# Altium project Radio_DownConverter.PrjPcb
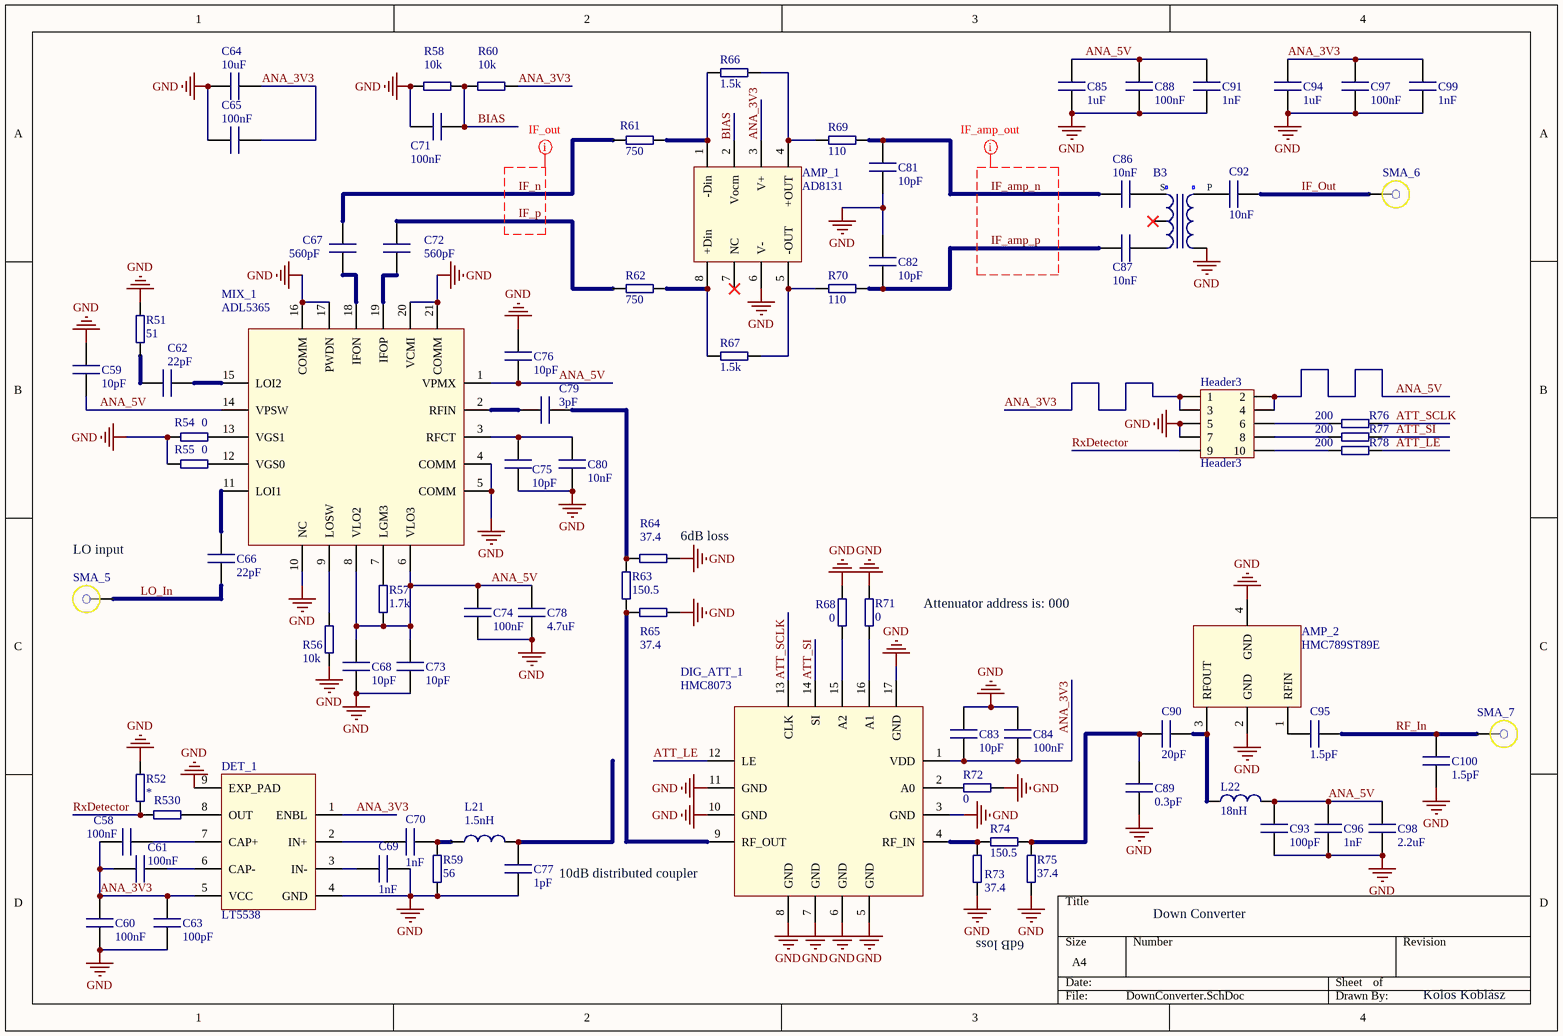
[diagram p0: DownConverter.SchDoc]
1 sheet, 83 parts. Net scope: global (net labels, ports and power ports of the same name join across sheets).

## Sheet DownConverter.SchDoc
size A4; DocumentNumber: 9; SheetNumber: 9; SheetTotal: 9

### Parts
AMP_1  AD8131
AMP_2  HMC789ST89E
B3  Balun  [Balun_Coil]  (value not drawn)
C58  value 100nF  [0805 SMD Passive]  (hidden comment: Cap1)
C59  value 10pF  [0805 SMD Passive]  (hidden comment: Cap1)
C60  value 100nF  [0805 SMD Passive]  (hidden comment: Cap1)
C61  value 100nF  [0805 SMD Passive]  (hidden comment: Cap1)
C62  value 22pF  [0805 SMD Passive]  (hidden comment: Cap1)
C63  value 100pF  [0805 SMD Passive]  (hidden comment: Cap1)
C64  value 10uF  [0805 SMD Passive]  (hidden comment: Cap1)
C65  value 100nF  [0805 SMD Passive]  (hidden comment: Cap1)
C66  value 22pF  [0805 SMD Passive]  (hidden comment: Cap1)
C67  value 560pF  [0805 SMD Passive]  (hidden comment: Cap1)
C68  value 10pF  [0805 SMD Passive]  (hidden comment: Cap1)
C69  value 1nF  [0805 SMD Passive]  (hidden comment: Cap1)
C70  value 1nF  [0805 SMD Passive]  (hidden comment: Cap1)
C71  value 100nF  [0805 SMD Passive]  (hidden comment: Cap1)
C72  value 560pF  [0805 SMD Passive]  (hidden comment: Cap1)
C73  value 10pF  [0805 SMD Passive]  (hidden comment: Cap1)
C74  value 100nF  [0805 SMD Passive]  (hidden comment: Cap1)
C75  value 10pF  [0805 SMD Passive]  (hidden comment: Cap1)
C76  value 10pF  [0805 SMD Passive]  (hidden comment: Cap1)
C77  value 1pF  [0805 SMD Passive]  (hidden comment: Cap1)
C78  value 4.7uF  [0805 SMD Passive]  (hidden comment: Cap1)
C79  value 3pF  [0805 SMD Passive]  (hidden comment: Cap1)
C80  value 10nF  [0805 SMD Passive]  (hidden comment: Cap1)
C81  value 10pF  [0805 SMD Passive]  (hidden comment: Cap1)
C82  value 10pF  [0805 SMD Passive]  (hidden comment: Cap1)
C83  value 10pF  [0805 SMD Passive]  (hidden comment: Cap1)
C84  value 100nF  [0805 SMD Passive]  (hidden comment: Cap1)
C85  value 1uF  [0805 SMD Passive]  (hidden comment: Cap1)
C86  value 10nF  [0805 SMD Passive]  (hidden comment: Cap1)
C87  value 10nF  [0805 SMD Passive]  (hidden comment: Cap1)
C88  value 100nF  [0805 SMD Passive]  (hidden comment: Cap1)
C89  value 0.3pF  [0805 SMD Passive]  (hidden comment: Cap1)
C90  value 20pF  [0805 SMD Passive]  (hidden comment: Cap1)
C91  value 1nF  [0805 SMD Passive]  (hidden comment: Cap1)
C92  value 10nF  [0805 SMD Passive]  (hidden comment: Cap1)
C93  value 100pF  [0805 SMD Passive]  (hidden comment: Cap1)
C94  value 1uF  [0805 SMD Passive]  (hidden comment: Cap1)
C95  value 1.5pF  [0805 SMD Passive]  (hidden comment: Cap1)
C96  value 1nF  [0805 SMD Passive]  (hidden comment: Cap1)
C97  value 100nF  [0805 SMD Passive]  (hidden comment: Cap1)
C98  value 2.2uF  [0805 SMD Passive]  (hidden comment: Cap1)
C99  value 1nF  [0805 SMD Passive]  (hidden comment: Cap1)
C100  value 1.5pF  [0805 SMD Passive]  (hidden comment: Cap1)
DET_1  LT5538
DIG_ATT_1  HMC8073
Header3  Header3  [Header3]
L21  value 1.5nH  [0805 SMD Passive]  (hidden comment: Inductor)
L22  value 18nH  [0805 SMD Passive]  (hidden comment: Inductor)
MIX_1  ADL5365
R51  value 51  [0805 SMD Passive]  (hidden comment: Resistor)
R52  Resistor  [0805 SMD Passive]  (value not drawn)
R53  value 0  [0805 SMD Passive]  (hidden comment: Resistor)
R54  value 0  [0805 SMD Passive]  (hidden comment: Resistor)
R55  value 0  [0805 SMD Passive]  (hidden comment: Resistor)
R56  value 10k  [0805 SMD Passive]  (hidden comment: Resistor)
R57  value 1.7k  [0805 SMD Passive]  (hidden comment: Resistor)
R58  value 10k  [0805 SMD Passive]  (hidden comment: Resistor)
R59  value 56  [0805 SMD Passive]  (hidden comment: Resistor)
R60  value 10k  [0805 SMD Passive]  (hidden comment: Resistor)
R61  value 750  [0805 SMD Passive]  (hidden comment: Resistor)
R62  value 750  [0805 SMD Passive]  (hidden comment: Resistor)
R63  value 150.5  [0805 SMD Passive]  (hidden comment: Resistor)
R64  value 37.4  [0805 SMD Passive]  (hidden comment: Resistor)
R65  value 37.4  [0805 SMD Passive]  (hidden comment: Resistor)
R66  value 1.5k  [0805 SMD Passive]  (hidden comment: Resistor)
R67  value 1.5k  [0805 SMD Passive]  (hidden comment: Resistor)
R68  value 0  [0805 SMD Passive]  (hidden comment: Resistor)
R69  value 110  [0805 SMD Passive]  (hidden comment: Resistor)
R70  value 110  [0805 SMD Passive]  (hidden comment: Resistor)
R71  value 0  [0805 SMD Passive]  (hidden comment: Resistor)
R72  value 0  [0805 SMD Passive]  (hidden comment: Resistor)
R73  value 37.4  [0805 SMD Passive]  (hidden comment: Resistor)
R74  value 150.5  [0805 SMD Passive]  (hidden comment: Resistor)
R75  value 37.4  [0805 SMD Passive]  (hidden comment: Resistor)
R76  value 200  [0805 SMD Passive]  (hidden comment: Resistor)
R77  value 200  [0805 SMD Passive]  (hidden comment: Resistor)
R78  value 200  [0805 SMD Passive]  (hidden comment: Resistor)
SMA_5  SMA1  [SMA Flange]  (value not drawn)
SMA_6  SMA1  [SMA Flange]  (value not drawn)
SMA_7  SMA1  [SMA Flange]  (value not drawn)

### Nets
GND: AMP_1.6(V-) AMP_2.2(GND) AMP_2.4(GND) B3.4 C59.1 C60.2 C63.2 C64.2 C65.1 C68.1 C69.1 C71.2 C73.1 C74.1 C75.1 C76.1 C77.1 C78.1 C80.1 C81.1 C82.2 C83.2 C84.2 C85.1 C88.1 C89.2 C91.1 C93.2 C94.1 C96.2 C97.1 C98.2 C99.1 C100.1 DET_1.4(GND) DET_1.9(EXP_PAD) DIG_ATT_1.3(GND) DIG_ATT_1.5(GND) DIG_ATT_1.6(GND) DIG_ATT_1.7(GND) DIG_ATT_1.8(GND) DIG_ATT_1.10(GND) DIG_ATT_1.11(GND) DIG_ATT_1.17(GND) Header3.5 Header3.7 MIX_1.4(COMM) MIX_1.5(COMM) MIX_1.10(NC) MIX_1.16(COMM) MIX_1.17(PWDN) MIX_1.20(VCMI) MIX_1.21(COMM) R51.1 R52.2 R54.2 R55.2 R56.1 R58.1 R59.1 R64.2 R65.2 R68.2 R71.2 R72.2 R73.2 R75.2
ANA_3V3: AMP_1.3(V+) C58.2 C60.1 C61.2 C63.1 C64.1 C65.2 C83.1 C84.1 C94.2 C97.2 C99.2 DET_1.1(ENBL) DET_1.5(VCC) DIG_ATT_1.1(VDD) Header3.1 Header3.3 R60.2
ANA_5V: C59.2 C68.2 C73.2 C74.2 C76.2 C78.2 C85.2 C88.2 C91.2 C93.1 C96.1 C98.1 Header3.2 Header3.4 L22.2 MIX_1.1(VPMX) MIX_1.6(VLO3) MIX_1.8(VLO2) MIX_1.14(VPSW) R57.1
ATT_LE: DIG_ATT_1.12(LE) R78.1
ATT_SCLK: DIG_ATT_1.13(CLK) R76.1
ATT_SI: DIG_ATT_1.14(SI) R77.1
BIAS: AMP_1.2(Vocm) C71.1 R58.2 R60.1
IF_amp_n: C81.2 C86.2 R69.2
IF_amp_p: C82.1 C87.2 R70.2
IF_n: C67.1 R61.1
IF_Out: C92.1 SMA_6.1
IF_p: C72.1 R62.1
LO_In: C66.1 SMA_5.1
RF_In: C95.1 C100.2 SMA_7.1
RxDetector: Header3.9 R52.1 R53.1
NetAMP_1_1: AMP_1.1(-Din) R61.2 R66.1
NetAMP_1_4: AMP_1.4(+OUT) R66.2 R69.1
NetAMP_1_5: AMP_1.5(-OUT) R67.2 R70.1
NetAMP_1_8: AMP_1.8(+Din) R62.2 R67.1
NetAMP_2_1: AMP_2.1(RFIN) C95.2
NetAMP_2_3: AMP_2.3(RFOUT) C90.1 L22.1
NetB3_1: B3.1 C86.1
NetB3_3: B3.3 C87.1
NetB3_5: B3.5 C92.2
NetC58_1: C58.1 DET_1.7(CAP+)
NetC61_1: C61.1 DET_1.6(CAP-)
NetC62_1: C62.1 R51.2
NetC62_2: C62.2 MIX_1.15(LOI2)
NetC66_2: C66.2 MIX_1.11(LOI1)
NetC67_2: C67.2 MIX_1.18(IFON)
NetC69_2: C69.2 DET_1.3(IN-)
NetC70_1: C70.1 L21.2 R59.2
NetC70_2: C70.2 DET_1.2(IN+)
NetC72_2: C72.2 MIX_1.19(IFOP)
NetC75_2: C75.2 C80.2 MIX_1.3(RFCT)
NetC77_2: C77.2 L21.1
NetC79_1: C79.1 R63.1 R64.1
NetC79_2: C79.2 MIX_1.2(RFIN)
NetC89_1: C89.1 C90.2 R74.1 R75.1
NetDET_1_8: DET_1.8(OUT) R53.2
NetDIG_ATT_1_2: DIG_ATT_1.2(A0) R72.1
NetDIG_ATT_1_4: DIG_ATT_1.4(RF_IN) R73.1 R74.2
NetDIG_ATT_1_9: DIG_ATT_1.9(RF_OUT) R63.2 R65.1
NetDIG_ATT_1_15: DIG_ATT_1.15(A2) R68.1
NetDIG_ATT_1_16: DIG_ATT_1.16(A1) R71.1
NetHeader3_6: Header3.6 R76.2
NetHeader3_8: Header3.8 R77.2
NetHeader3_10: Header3.10 R78.2
NetMIX_1_7: MIX_1.7(LGM3) R57.2
NetMIX_1_9: MIX_1.9(LOSW) R56.2
NetMIX_1_12: MIX_1.12(VGS0) R55.1
NetMIX_1_13: MIX_1.13(VGS1) R54.1

Not connected (* = marked no-connect by the designer): AMP_1 7(NC)*; B3 2*

### Layout directives
net class ADC_DataBus: IF_amp_n, IF_amp_p, IF_n, IF_p

### Notes on the sheet
- (near SMA_5) LO input
- (near R64) 6dB loss
- Attenuator address is: 000
- (near DIG_ATT_1) 10dB distributed coupler
- (near R75) Down Converter
- 6dB loss
- Kolos Koblász
- (in symbol Balun1) S; P

### Library data of the parts
AMP_1 = AD8131: High Speed Differential Driver; Manufacturer: Analog Devices; Order Code: AD8131AR; Package Description: 8-Lead SSOP (SOIC_N); PartNumber: AD8131
AMP_2 = HMC789ST89E: Gain Block MMIC; Manufacturer: Analog Devices; Package Description: SOT89; Order Code: HMC789ST89E; PartNumber: HMC789ST89E
B3 = Balun1: SMD Balun; MaxFrequency: 500MHz; MinFrequency: 5MHz; ImpedanceTransformation P : S: 2:1; FootPrint: SMD; Manufacturer: *; PartNumber: *
C58-C100 = Cap1: SMD Capacitor; Precision: 1%; MaxVolt: 16V; FootPrint: *
DET_1 = LT5538: Detector; Manufacturer: Analog Devices; Order Code: LT5538IDD#PBF; Package Description: 8-Lead Plastic DFN; PartNumber: LT5538
DIG_ATT_1 = HMC8073: Digital Attenuator; Manufacturer: Analog Devices; Order Code: HMC8073LP3DE; Package Description: 16-Lead LFCSP; PartNumber: HMC8073
Header3 = Header3: 10 pin DIL header; PinNumber: 10; Row: 2; Pitch: 2.54mm; Type: Straight
L21 L22 = Ind1: SMD Inductor; Precision: 10%; MaxCurent: 100mA; FootPrint: SMD
MIX_1 = ADL5365: RF Mixer; Manufacturer: Analog Devices; Order Code: ADL5365ACPZ-R7; Package Description: 20-Lead LFCSP_WQ; PartNumber: ADL5365
R51-R78 = Res1: SMD Resistor; Precision: 1%; MaxPower: 0.1W; FootPrint: SMD
  R52: Value: *
SMA_5-SMA_7 = SMA1: SMA Female; Shape: 90°; Footprint: *; PartNumber: *; Manufacturer: *; OrderCode: *; Mounting: TroughHole